# Altium project 输入耦合衰减.PrjPcb
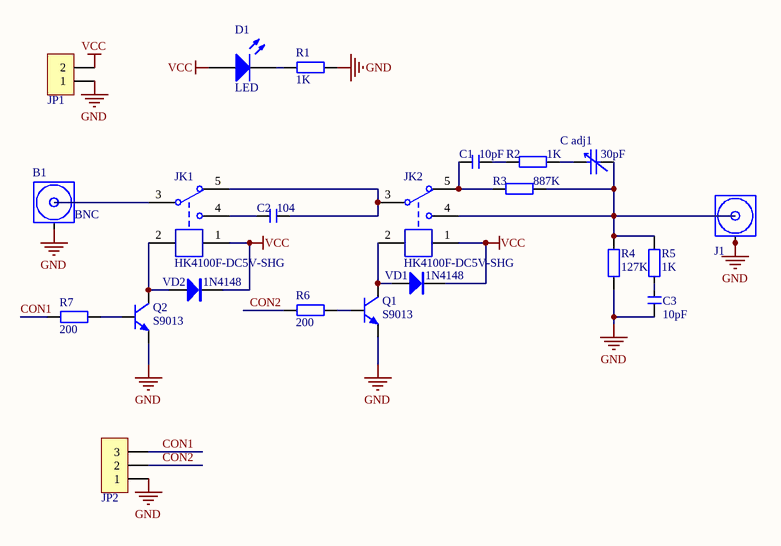
[diagram p0: 输入耦合衰减.SchDoc]
1 sheet, 22 parts. Net scope: global (net labels, ports and power ports of the same name join across sheets).
Board file: 输入耦合衰减.PcbDoc

## Sheet 输入耦合衰减.SchDoc
size A4

### Parts
B1  BNC  [BNC]
C1  10pF  [C 0603]
C2  104  [C 0805]
C3  10pF  [C 0603]
C_adj1  value 30pF  [Cap adj]  (hidden comment: C adj)
D1  LED  [LED_0805]
J1  COAX  [MCX5.08-5-H]  (value not drawn)
JK1  HK4100F-DC5V-SHG  [HK4100F]
JK2  HK4100F-DC5V-SHG  [HK4100F]
JP1  HDR-1X2  [XH2.54-2P_H]  (value not drawn)
JP2  HDR-1X3  [HDR-1X3]  (value not drawn)
Q1  S9013  [SOT23-3N]
Q2  S9013  [SOT23-3N]
R1  1K  [R 0805]
R2  1K  [R 0603]
R3  887K  [R 0603]
R4  127K  [R 0603]
R5  1K  [R 0603]
R6  200  [R 0603]
R7  200  [R 0603]
VD1  1N4148  [SOD-323]
VD2  1N4148  [SOD-323]

### Nets
GND: B1.2(GND) C3.1 J1.2(GND) J1.3(GND) J1.4(GND) J1.5(GND) JP1.1 JP2.1 Q1.2(E) Q2.2(E) R1.2 R4.1
VCC: D1.1(A) JK1.1 JK2.1 JP1.2 VD1.2(K) VD2.2(K)
CON1: JP2.3 R7.1
CON2: JP2.2 R6.1
NetB1_1: B1.1(Signal) JK1.3
NetC1_1: C1.1 JK2.5 R3.1
NetC1_2: C1.2 R2.1
NetC2_1: C2.1 JK1.4
NetC2_2: C2.2 JK1.5 JK2.3
NetC3_2: C3.2 R5.1
NetC_adj1_1: C_adj1.1 R2.2
NetC_adj1_2: C_adj1.2 J1.1(Signal) JK2.4 R3.2 R4.2 R5.2
NetD1_2: D1.2(K) R1.1
NetJK1_2: JK1.2 Q2.3(C) VD2.1(A)
NetJK2_2: JK2.2 Q1.3(C) VD1.1(A)
NetQ1_1: Q1.1(B) R6.2
NetQ2_1: Q2.1(B) R7.2

### Library data of the parts
B1 = BNC: BNC座子
C1-C3 = C: 无极性贴片电容; 版权归属: 源创客; BOM名称: 无极性贴片电容; 学习资源: www.ooocke.com
C_adj1 = Cap adj
D1 = LED: 发光二极管; Published: 8-Jun-2000; LatestRevisionDate: 08-Jul-2005; LatestRevisionNote: Mech Layer 1 removed.; PackageReference: LED; Publisher: Altium Limited
JK1 JK2 = HK4100F: 单路双控继电器; 版权归属: 源创客; BOM名称: 单路双控继电器; 学习资源: www.ooocke.com
JP1 = Header 2: 2P接插件; 版权归属: 源创客; BOM名称: 2P接插件; 学习资源: www.ooocke.com
JP2 = Header 3: 3P接插件; 版权归属: 源创客; BOM名称: 3P接插件; 学习资源: www.ooocke.com
Q1 Q2 = 9013-SMD: 低频放大-NPN型; 版权归属: 源创客; 属性: 50V 0.5A 0.625W; BOM名称: 低频放大-NPN型; 学习资源: www.ooocke.com
R1-R7 = R: 贴片电阻; 版权归属: 源创客; BOM名称: 贴片电阻; 学习资源: www.ooocke.com
VD1 VD2 = 1N4148: 高速开关二极管; 版权归属: 源创客; BOM名称: 高速开关二极管; 学习资源: www.ooocke.com